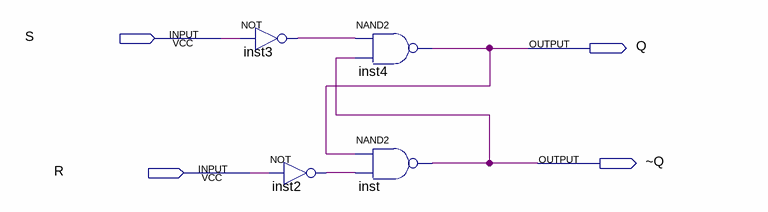
[diagram p0: schematic sheet]
// Quartus schematic lab9step1.bdf as structural Verilog: 4 symbols, 4 pins
module lab9step1 (
  input  S,
  input  R,
  output Q,
  output \~Q 
);

  wire inst2_out, inst3_out;

  not inst3 (inst3_out, S);
  not inst2 (inst2_out, R);
  nand inst4 (Q, inst3_out, \~Q );
  nand inst (\~Q , Q, inst2_out);
endmodule
